# EAGLE design iGlass v3 (EAGLE 9.6.2)
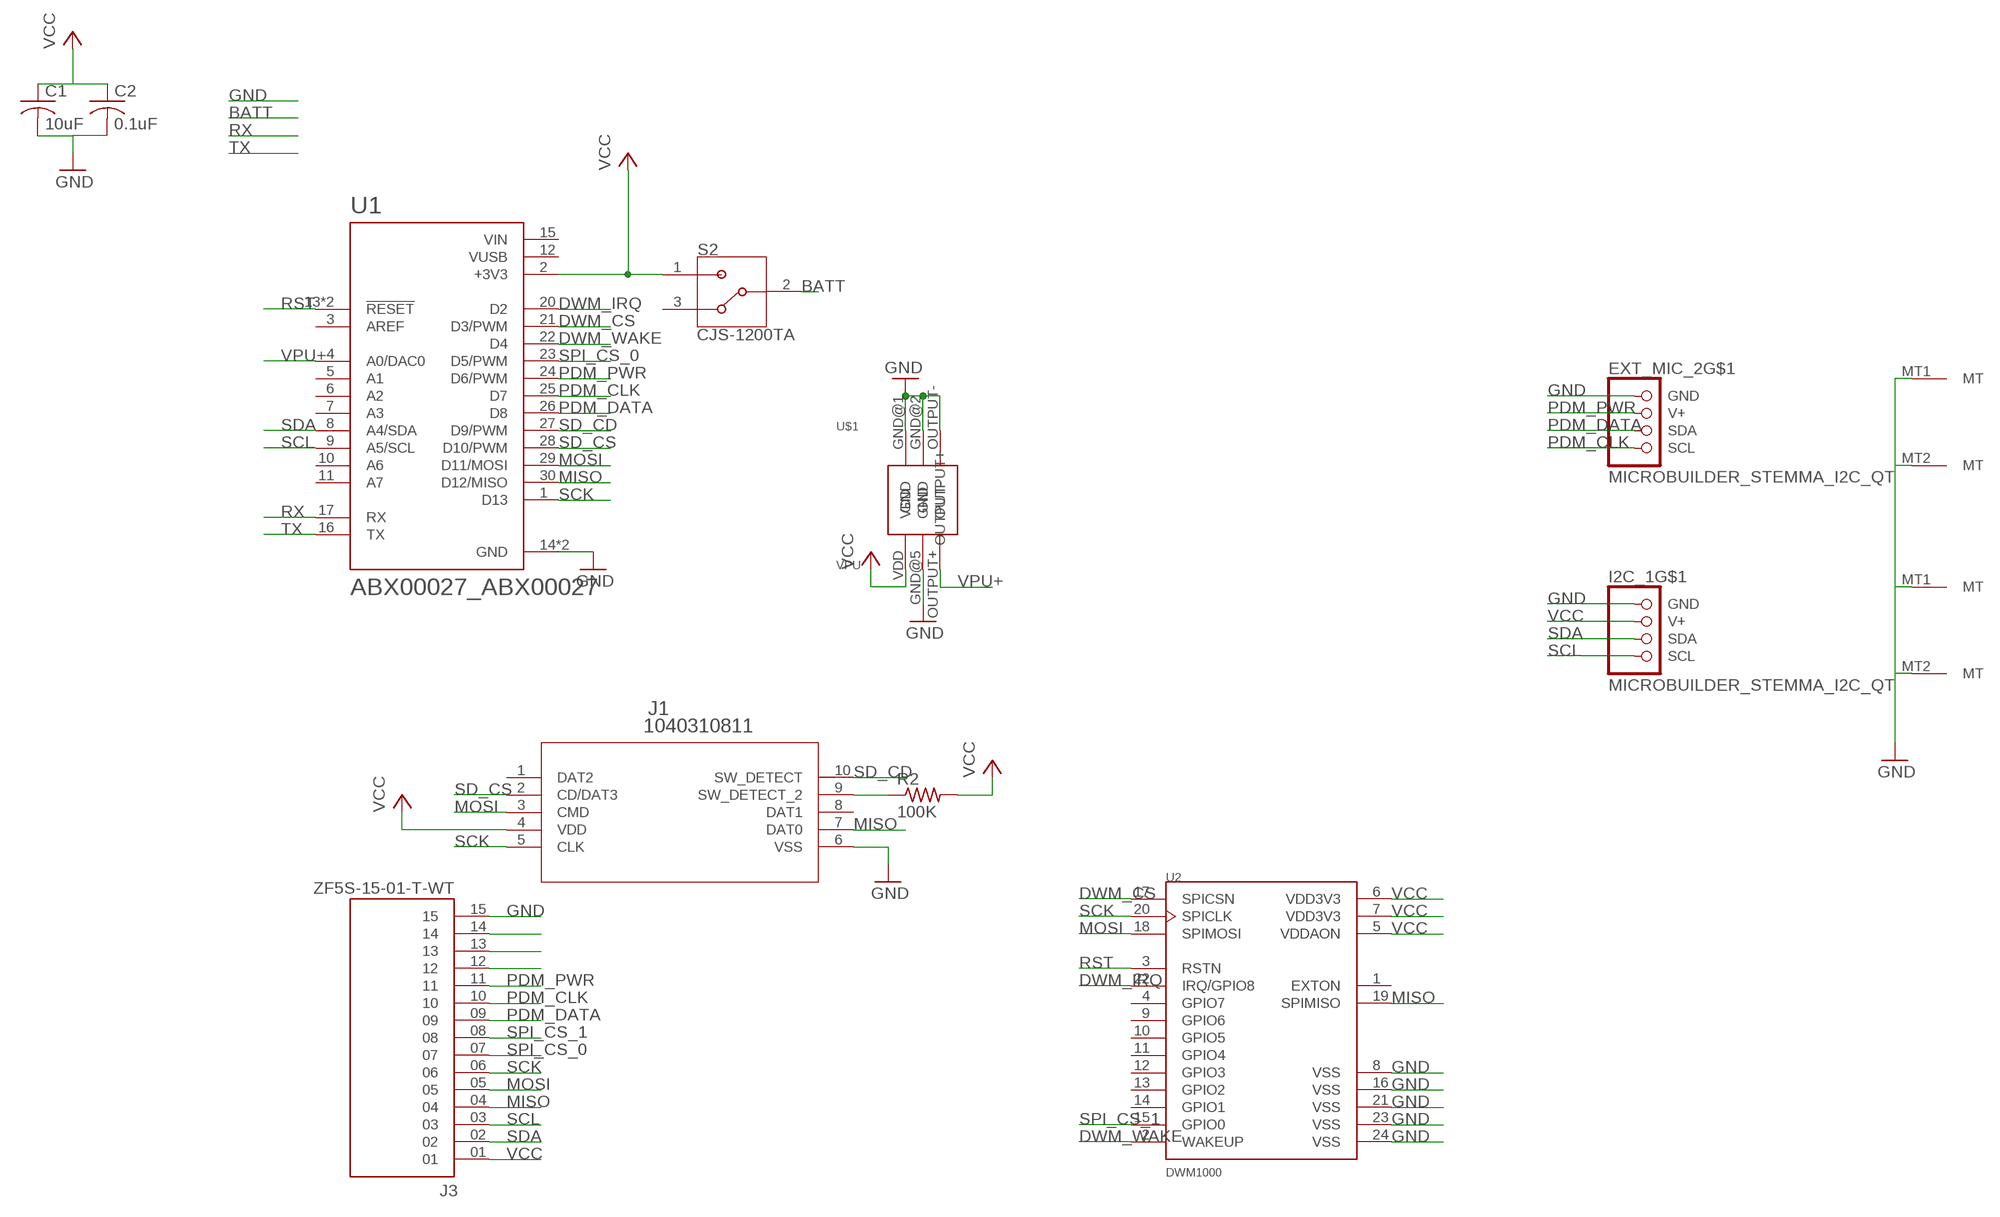
[diagram p0: schematic, sheet 1]

## Parts
C1  10uF  C-USC0805  [C0805]
C2  0.1uF  C-USC0805  [C0805]
EXT_MIC_2  MICROBUILDER_STEMMA_I2C_QT  [MICROBUILDER_JST_SH4]
I2C_1  MICROBUILDER_STEMMA_I2C_QT  [MICROBUILDER_JST_SH4]
J1  1040310811  [104031-0811_MOL]
J3  ZF5S-15-01-T-WT  [SAMTEC_ZF5S-15-01-T-WT]
R2  100K  R-US_R0805  [R0805]
S2  CJS-1200TA  [SW_CJS-1200TA]
U1  ABX00027_ABX00027  [ABX00027_MODULE_ABX00027]
U2  DWM1000  [XCVR_DWM1000]
U$1  VPU  [VPU]

## Nets
BATT: S2.2
DWM_CS: U1.21(D3/PWM) U2.17(SPICSN)
DWM_IRQ: U1.20(D2) U2.22(IRQ/GPIO8)
DWM_WAKE: U1.22(D4) U2.2(WAKEUP)
GND: C1.2 C2.2 EXT_MIC_2.1(GND) EXT_MIC_2.MT1(MT) EXT_MIC_2.MT2(MT) I2C_1.1(GND) I2C_1.MT1(MT) I2C_1.MT2(MT) J1.6(VSS) J3.14 J3.15 U1.14(GND) U1.19(GND) U2.8(VSS) U2.16(VSS) U2.21(VSS) U2.23(VSS) U2.24(VSS) U$1.GND@1(GND) U$1.GND@2(GND) U$1.GND@5(GND) U$1.OUTPUT-
MISO: J1.7(DAT0) J3.04 U1.30(D12/MISO) U2.19(SPIMISO)
MOSI: J1.3(CMD) J3.05 U1.29(D11/MOSI) U2.18(SPIMOSI)
N$3: J1.9(SW_DETECT_2) R2.1
N$4: J3.13
N$5: J3.12
PDM_CLK: EXT_MIC_2.4(SCL) J3.10 U1.25(D7)
PDM_DATA: EXT_MIC_2.3(SDA) J3.09 U1.26(D8)
PDM_PWR: EXT_MIC_2.2(V+) J3.11 U1.24(D6/PWM)
RST: U1.13(!RESET) U1.18(!RESET) U2.3(RSTN)
RX: U1.17(RX)
SCK: J1.5(CLK) J3.06 U1.1(D13) U2.20(SPICLK)
SCL: I2C_1.4(SCL) J3.03 U1.9(A5/SCL)
SD_CD: J1.10(SW_DETECT) U1.27(D9/PWM)
SD_CS: J1.2(CD/DAT3) U1.28(D10/PWM)
SDA: I2C_1.3(SDA) J3.02 U1.8(A4/SDA)
SPI_CS_0: J3.07 U1.23(D5/PWM)
SPI_CS_1: J3.08 U2.15(GPIO0)
TX: U1.16(TX)
VCC: C1.1 C2.1 I2C_1.2(V+) J1.4(VDD) J3.01 R2.2 S2.1 U1.2(+3V3) U2.5(VDDAON) U2.6(VDD3V3) U2.7(VDD3V3) U$1.VDD
VPU+: U1.4(A0/DAC0) U$1.OUTPUT+
Unconnected: J1.1(DAT2) J1.8(DAT1) S2.3 U1.3(AREF) U1.5(A1) U1.6(A2) U1.7(A3) U1.10(A6) U1.11(A7) U2.1(EXTON) U2.4(GPIO7) U2.9(GPIO6) U2.10(GPIO5) U2.11(GPIO4) U2.12(GPIO3) U2.13(GPIO2) U2.14(GPIO1)

## Power pins joined to a net without a drawn wire
VIN: U1.15(VIN)
VUSB: U1.12(VUSB)

## Library data of the parts
C1 C2 = rcl:C-US: CAPACITOR, American symbol
EXT_MIC_2 I2C_1 = smart-glasses:MICROBUILDER_STEMMA_I2C
J1 = micro_sd_slot:1040310811; COPYRIGHT: Copyright (C) 2021 Ultra Librarian. All rights reserved.; MANUFACTURER_PART_NUMBER: 1040310811; MFR_NAME: Molex Connector Corporation
J3 = ZF5S-15-01-T-WT:ZF5S-15-01-T-WT; MANUFACTURER: SAMTEC
R2 = resistor:R-US_: RESISTOR, American symbol
S2 = CJS-1200TA:CJS-1200TA: Switch Slide N.O./N.C. SPDT Raised Slide 0.1A 24VDC J-Hook SMD Embossed T/R Check availability <https://pricing.snapeda.com/parts/CJS-1200TA/Nidec%20Copal/view-part?ref=eda>; AVAILABILITY: In Stock; DESCRIPTION: Slide Switch SPDT Surface Mount; MF: Nidec Copal; MP: CJS-1200TA; PACKAGE: None; PRICE: None; PURCHASE-URL: https://pricing.snapeda.com/search/part/CJS-1200TA/?ref=eda
U1 = smart-glasses:ABX00027_ABX00027: ATSAMD21G18A Arduino Nano 33 IoT SAM D ARM® Cortex®-M0+ MCU 32-Bit Embedded Evaluation Board Check prices <https://pricing.snapeda.com/parts/ABX00027/Arduino/view-part?ref=eda>; AVAILABILITY: In Stock; DESCRIPTION: ATSAMD21G18A Arduino Nano 33 IoT SAM D ARM® Cortex®-M0+ MCU 32-Bit Embedded Evaluation Board; MF: Arduino; MP: ABX00027; PACKAGE: None; PRICE: None; PURCHASE-URL: https://pricing.snapeda.com/search/part/ABX00027/?ref=eda
U2 = DWM1000:DWM1000: Mod Ieee802.15.4-2011 Uwb Txrx Check availability <https://pricing.snapeda.com/parts/DWM1000/Qorvo/view-part?ref=eda>; AVAILABILITY: In Stock; DESCRIPTION: RX TXRX MODULE 802.15.4 CHIP SMD; MF: Qorvo; MP: DWM1000; PACKAGE: None; PRICE: None; PURCHASE-URL: https://pricing.snapeda.com/search/part/DWM1000/?ref=eda
U$1 = VPU:VPU

## Board
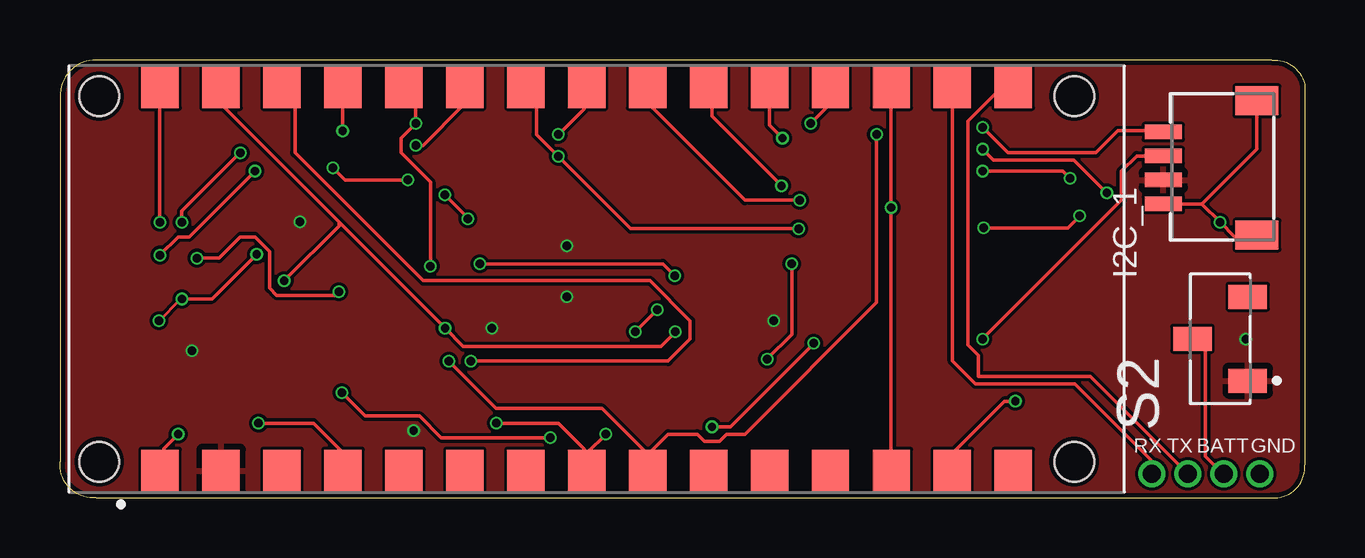
[diagram p1: board, top side]
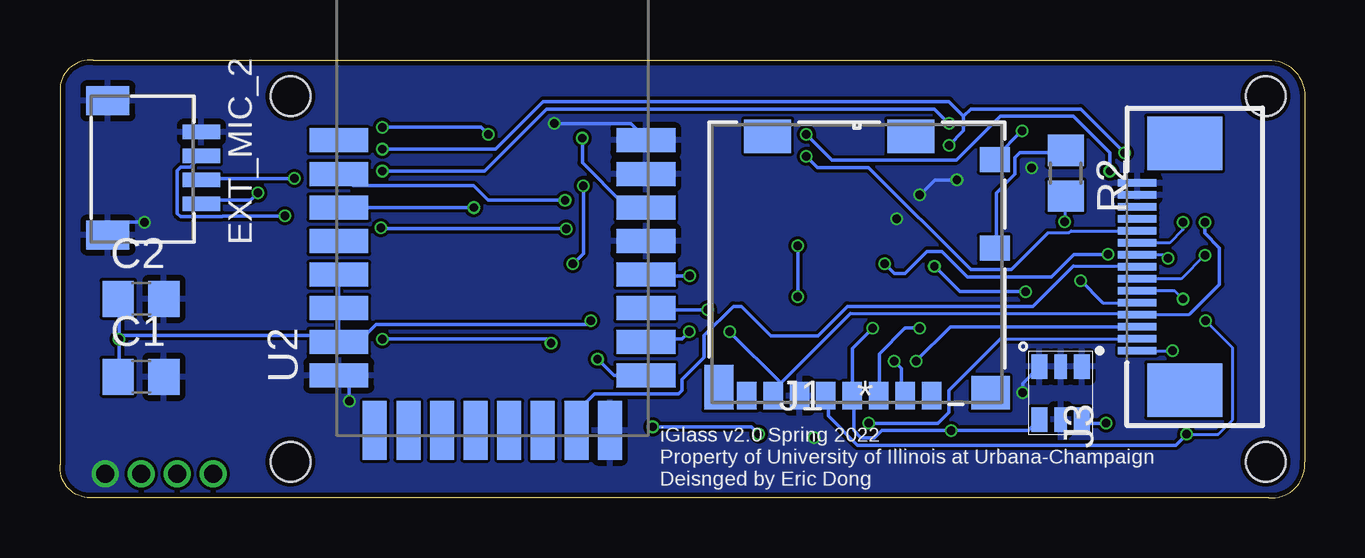
[diagram p2: board, bottom side, seen from below]

Size 51.89 x 18.26 mm. Coordinates in mm from the lower left corner, seen from the top.
Outline: 1.51,0.01 50.51,0.01 arc101 51.88,1.38 51.88,17.26 arc79 50.51,18.26 1.51,18.26 arc85 0.01,16.88 0.01,1.51 arc100 1.51,0.01
Copper layers (1*16): Top 0.035559375mm / dielectric 1.6mm / Bottom 0.035559375mm
Design rules "jlcpcb2layer": minimum track width 5mil, minimum drill 12mil, track to track 5mil, track to pad 5mil, pad to pad 5mil, via to via 5mil, smd to smd 5mil, copper to edge 8mil, drill to drill 6mil, minimum pad ring 5mil, minimum via ring 3mil, stop-mask expansion 2.5mil, vias tented up to drill 0mil, thermal gap 10mil

### Footprints (pad centres in the part's own frame; a part is rotated, then mirrored left to right if it is on the bottom)
C0805 = smd 1.3 x 1.5: 1 -0.95,0; 2 0.95,0
MICROBUILDER_JST_SH4 = smd 0.6 x 1.55: 1 -1.5,2.514; 2 -0.5,2.514; 3 0.5,2.514; 4 1.5,2.514 | smd 1.2 x 1.8: MT1 -2.8,-1.386; MT2 2.8,-1.386
104031-0811_MOL = smd 0.813 x 1.143: 1 3.105,-5.521; 2 2.005,-5.521; 3 0.905,-5.521; 4 -0.195,-5.521; 5 -1.295,-5.521; 6 -2.395,-5.521; 7 -3.495,-5.521; 8 -4.595,-5.521 | smd 1.245 x 1.041: 9 5.74,0.628; 10 5.74,4.329 | smd 1.6 x 1.397: 11 5.565,-5.396 | smd 1.219 x 1.854: 12 -5.755,-5.171 | smd 1.956 x 1.397: 13 -3.73,5.303; 14 2.24,5.303
SAMTEC_ZF5S-15-01-T-WT = smd 0.3 x 1.6: 01 -3.5,1.98; 02 -3,1.98; 03 -2.5,1.98; 04 -2,1.98; 05 -1.5,1.98; 06 -1,1.98; 07 -0.5,1.98; 08 0,1.98; 09 0.5,1.98; 10 1,1.98; 11 1.5,1.98; 12 2,1.98; 13 2.5,1.98; 14 3,1.98; 15 3.5,1.98 | smd 2.24 x 3.12: S1 -5.147,0; S2 5.147,0
R0805 = smd 1.3 x 1.5: 1 -0.95,0; 2 0.95,0
SW_CJS-1200TA = smd 1 x 1.6: 1 -1.75,-1.15; 2 0,1.15; 3 1.75,-1.15
ABX00027_MODULE_ABX00027 = smd 1.56 x 1.75: 1 -18.19,-8; 2 -15.65,-8; 3 -13.11,-8; 4 -10.57,-8; 5 -8.03,-8; 6 -5.49,-8; 7 -2.95,-8; 8 -0.41,-8; 9 2.13,-8; 10 4.67,-8; 11 7.21,-8; 12 9.75,-8; 13 12.29,-8; 14 14.83,-8; 15 17.37,-8; 16 17.37,8; 17 14.83,8; 18 12.29,8; 19 9.75,8; 20 7.21,8; 21 4.67,8; 22 2.13,8; 23 -0.41,8; 24 -2.95,8; 25 -5.49,8; 26 -8.03,8; 27 -10.57,8; 28 -13.11,8; 29 -15.65,8; 30 -18.19,8 | hole 1.651: -20.73,-7.62; -20.73,7.62; 19.91,7.62; 19.91,-7.62
XCVR_DWM1000 = smd 2.45 x 1: 1 -6.4,1.8; 2 -6.4,0.4; 3 -6.4,-1; 4 -6.4,-2.4; 5 -6.4,-3.8; 6 -6.4,-5.2; 7 -6.4,-6.6; 8 -6.4,-8; 17 6.4,-8; 18 6.4,-6.6; 19 6.4,-5.2; 20 6.4,-3.8; 21 6.4,-2.4; 22 6.4,-1; 23 6.4,0.4; 24 6.4,1.8 | smd 1 x 2.45: 9 -4.9,-10.295; 10 -3.5,-10.295; 11 -2.1,-10.295; 12 -0.7,-10.295; 13 0.7,-10.295; 14 2.1,-10.295; 15 3.5,-10.295; 16 4.9,-10.295
VPU = smd 0.662 x 1.03: GND@1 -0.884,1.105; OUTPUT+ 0.884,-1.105; OUTPUT- 0.884,1.105; VDD -0.884,-1.105 | smd 0.533 x 1.03: GND@2 0,1.105; GND@5 0,-1.105

### Placement (x,y rotation side)
C1  48.51,5.05 0 bottom
C2  48.51,8.3 0 bottom
EXT_MIC_2  48.51,13.76 270 bottom
I2C_1  48.51,13.76 90 top
J1  18.67,9.78 0 bottom
J3  5.01,9.63 90 bottom
R2  9.97,13.54 270 bottom
S2  48.36,6.63 90 top
U1  22.37,9.13 0 top
U2  33.87,13.11 0 bottom
U$1  10.18,4.37 0 bottom

### Tracks (layer width: path | path; a pad name or v marks a point on that pad's centre or on a via)
BATT  (via drill 0.75)
  Top 0.152: S2.2 47.29,6.61 47.75,6.16 47.75,1.74 48.48,1.01 v48.51,1.01
DWM_CS  (via drill 0.35)
  Top 0.152: v30.07,13.02 27.18,15.91 27.18,16.98 U1.21 | v30.51,9.76 30.51,6.81 v29.48,5.78
  Bottom 0.152: v30.07,13.02 30.07,10.19 v30.51,9.76 | v29.48,5.78 28.8,5.11 U2.17
DWM_IRQ  (via drill 0.35)
  Top 0.152: v30.11,15 29.58,15.53 U1.20
  Bottom 0.152: v30.11,15 30.11,13.97 28.39,12.25 27.48,12.25 U2.22
DWM_WAKE  (via drill 0.35)
  Top 0.152: v30.83,12.41 28.55,12.41 24.58,16.37 24.58,16.98 U1.22
  Bottom 0.152: v30.83,12.41 34.03,12.41 34.64,13.02 39.67,13.02 40.13,13.47 U2.2
GND  (via drill 0.35, 0.75)
  Top 0.152: 47.6,12.25 46.07,12.25 I2C_1.1 | 47.6,12.25 v48.36,11.49 48.97,10.88 49.88,10.88 EXT_MIC_2.MT2 | 47.6,12.25 49.88,14.54 49.88,16.52 EXT_MIC_2.MT1 | v39.82,4.02 39.37,4.02 37.23,1.89 37.23,1.13 U1.14 | v31.29,15.61 32.05,16.37 32.05,16.98 U1.19 | v20.44,2.5 15.9,2.5 14.99,3.41 12.73,3.41 v11.76,4.38 | v11.38,13.76 11.89,13.25 v14.5,13.25 | v16.05,12.63 17.01,11.67 v17.01,11.63
  Bottom 0.152: v39.82,4.02 39.82,4.79 40.13,5.09 U2.8 | v31.29,15.61 28.09,15.61 27.48,15 U2.24 | v48.36,11.49 49.43,11.49 49.88,11.03 EXT_MIC_2.MT2 | U$1.GND@1 11.76,4.78 v11.76,4.38 | v14.5,13.25 15.43,13.25 v16.05,12.63
  other vias: 50.01,1.01
  pour Bottom: 0.01,18.76 0.01,-0.74 52.01,-0.74 52.01,18.76
MISO  (via drill 0.35)
  Top 0.152: v4.16,11.49 4.16,16.98 U1.30 | v23.98,6.92 v24.89,7.83
  Bottom 0.127: 4.77,7.68 4.82,7.63 J3.04 7.04,7.68 18.95,7.68
  Bottom 0.152: 21.84,4.79 21.84,4.63 22.15,4.33 J1.7 21.84,4.79 | 21.84,4.79 18.95,7.68 | v4.16,11.49 4.16,11.03 3.55,10.42 3.55,8.9 4.77,7.68 | v24.89,7.83 27.33,7.83 U2.19 | 21.84,4.79 v23.98,6.92
MOSI  (via drill 0.35)
  Top 0.152: 11.63,11.49 6.75,16.37 6.75,16.98 U1.29 | 11.63,11.49 v16.05,7.07 16.81,6.31 25.04,6.31 v25.65,6.92 | v9.34,9.05 11.63,11.34 11.63,11.49
  Bottom 0.127: 8.43,8.14 8.42,8.13 J3.05
  Bottom 0.152: v16.05,7.07 16.66,7.07 17.73,6 17.73,4.33 J1.3 | v9.34,9.05 8.43,8.14 | v25.65,6.92 25.96,6.61 27.33,6.61 U2.18
N$3
  Bottom 0.152: J1.9 12.85,10.42 12.85,12.71 12.07,13.49 12.07,14.19 11.88,14.39 10.11,14.39 R2.1
PDM_CLK  (via drill 0.35)
  Top 0.152: v43.63,12.71 42.26,14.08 38.91,14.08 v38.45,14.54 | v14.83,14.69 15.14,14.69 16.81,16.37 16.81,16.98 U1.25 | v5.08,11.49 5.08,11.95 v7.52,14.39
  Bottom 0.127: 5.08,11.19 5.63,10.63 J3.10
  Bottom 0.152: v43.63,12.71 43.94,12.41 45.92,12.41 EXT_MIC_2.4 | v38.45,14.54 33.73,14.54 31.75,16.52 14.83,16.52 14.22,15.91 | 14.22,15.91 14.22,15.3 v14.83,14.69 | v5.08,11.49 5.08,11.19 | v7.52,14.39 9.34,16.22 13.92,16.22 14.22,15.91
PDM_DATA  (via drill 0.35)
  Top 0.152: v42.11,13.32 41.81,13.62 v38.45,13.62 | U1.26 14.37,16.98 14.83,16.52 v14.83,15.61 14.22,15 14.22,14.39 15.44,13.17 v15.44,9.66 | v5.7,9.99 6.63,9.99 7.52,10.88 8.13,10.88 8.74,10.27 8.74,8.75 9.04,8.44 11.48,8.44 v11.63,8.6
  Bottom 0.127: v5.7,9.99 5.84,10.13 J3.09
  Bottom 0.152: v42.11,13.32 45.92,13.32 EXT_MIC_2.3 | v38.45,13.62 34.19,13.62 31.6,16.22 15.44,16.22 v14.83,15.61 | v11.63,8.6 14.37,8.6 v15.44,9.66
PDM_PWR  (via drill 0.35)
  Top 0.152: v30.79,11.22 23.79,11.22 v20.77,14.23 19.86,15.15 19.86,16.67 19.56,16.98 U1.24 | v42.51,11.76 42.01,11.26 v38.51,11.26
  Bottom 0.127: J3.11 9.74,11.13 9.82,11.05 10.7,11.05 10.72,11.03
  Bottom 0.152: 10.72,11.03 12.24,9.51 13.92,9.51 18.18,13.78 20.32,13.78 v20.77,14.23 | v42.51,11.76 45.09,11.76 45.12,11.73 46.86,11.73 47,11.86 47,13.65 46.86,13.79 46.46,13.79 EXT_MIC_2.2 | v38.51,11.26 38.47,11.22 v30.79,11.22
RST  (via drill 0.35)
  Top 0.152: U1.13 34.64,1.13 v34.64,12.1 34.64,16.98 U1.18
  Bottom 0.152: v34.64,12.1 40.13,12.1 U2.3
RX  (via drill 0.75)
  Top 0.152: U1.17 37.2,5.7 38.15,4.75 42.29,4.75 45.46,1.59 45.46,1.05 v45.51,1.01
SCK  (via drill 0.35)
  Top 0.127: v4.13,7.38 5.04,8.29 v5.08,8.29
  Top 0.152: v4.93,2.65 4.32,2.04 4.32,1.13 U1.1 | v8.2,10.15 6.34,8.29 v5.08,8.29 | v17.51,9.76 25.13,9.76 v25.63,9.26
  Bottom 0.127: v4.93,2.65 3.61,2.65 3.01,3.26 3.01,6.26 v4.13,7.38 | v5.08,8.29 5.42,8.63 J3.06
  Bottom 0.152: v4.93,2.65 5.38,2.19 18.64,2.19 19.86,3.41 19.86,4.18 J1.5 | v8.2,10.15 9.62,10.15 10.56,9.21 14.07,9.21 15.14,10.27 15.75,10.27 16.66,9.36 17.11,9.36 v17.51,9.76 | U2.20 27.33,9.36 27.23,9.26 v25.63,9.26
SCL  (via drill 0.35)
  Top 0.152: v38.45,15.45 39.52,14.39 43.18,14.39 44.09,15.3 45.95,15.3 I2C_1.4 | v34.03,15.15 34.03,8.14 28.55,2.65 27.79,2.65 27.48,2.35 26.87,2.35 26.57,2.65 25.35,2.65 24.58,1.89 24.58,1.74 | 24.58,1.74 24.58,1.13 U1.9 24.58,1.74 | v16.2,5.7 18.18,3.72 22.6,3.72 24.58,1.74
  Bottom 0.152: v38.45,15.45 34.34,15.45 v34.03,15.15 | J3.03 14.77,7.13 v16.2,5.7
SD_CD  (via drill 0.35)
  Top 0.152: v11.78,15.3 11.78,16.98 U1.27
  Bottom 0.152: v11.78,15.3 12.85,14.23 J1.10
SD_CS  (via drill 0.35)
  Top 0.152: v17.12,5.7 25.35,5.7 26.26,6.61 26.26,7.38 24.58,9.05 15.14,9.05 9.8,14.39 9.8,16.52 9.34,16.98 U1.28
  Bottom 0.152: v17.12,5.7 16.81,5.4 16.81,4.33 J1.2
SDA  (via drill 0.35)
  Top 0.152: v38.45,6.61 44.24,12.41 44.24,13.62 44.88,14.26 I2C_1.3 | v31.42,6.44 27.94,2.96 v27.18,2.96 | v22.76,2.65 21.99,1.89 21.99,1.74 | 21.99,1.74 21.99,1.13 U1.8 21.99,1.74 | v18.18,3.11 20.77,3.11 21.84,2.04 21.84,1.89 21.99,1.74
  Bottom 0.127: 12.7,6.61 12.68,6.63 J3.02
  Bottom 0.152: v38.45,6.61 31.6,6.61 v31.42,6.44 | v27.18,2.96 23.06,2.96 v22.76,2.65 | 12.7,6.61 14.83,4.48 14.83,3.57 15.29,3.11 v18.18,3.11
SPI_CS_0  (via drill 0.35)
  Top 0.152: v4.16,10.12 4.93,10.88 5.38,10.88 v8.13,13.62 | v20.77,15.15 21.84,16.22 21.84,16.98 U1.23
  Bottom 0.127: J3.07 5.15,9.13 v4.16,10.12
  Bottom 0.152: v8.13,13.62 8.13,14.39 9.65,15.91 12.7,15.91 14.53,14.08 19.71,14.08 v20.77,15.15
SPI_CS_1
  Bottom 0.127: 9.65,9.66 7.02,9.66 J3.08
  Bottom 0.152: 9.65,9.66 11.33,7.99 19.07,7.99 20.3,6.76 22.26,6.76 23.49,7.99 23.82,7.99 25.04,6.77 25.04,5.85 25.96,4.94 25.96,4.48 26.11,4.33 29.61,4.33 30.22,3.72 30.22,2.96 U2.15
TX  (via drill 0.75)
  Top 0.152: v47.01,1.01 42.95,5.06 38.27,5.06 38.27,5.93 37.85,6.36 37.85,15.71 39.27,17.13 U1.16
VCC  (via drill 0.35)
  Bottom 0.127: J3.01 v5.51,6.13 | R2.2 10.01,12.55 v10.01,11.51
  Bottom 0.152: 49.43,6.77 49.43,8.29 C2.1 | 49.43,6.77 v49.43,6.61 49.43,5.09 C1.1 | 40.28,6.77 40.28,7.83 U2.6 40.28,7.99 40.28,9.21 U2.5 | 40.28,6.77 40.28,6.61 U2.7 | 40.28,6.77 49.43,6.77 | 40.28,6.77 U2.7 | 11.02,3.57 11.02,3.26 U$1.VDD | 11.17,3.11 U$1.VDD | 9.95,12.71 R2.2 | U$1.VDD 11.52,2.8 v14.74,2.8 17.63,2.8 17.93,2.5 18.49,2.5 18.79,2.8 18.79,4.18 J1.4 18.86,6.22 v18.01,7.07 | U2.7 39.42,6.51 38.7,7.22 29.92,7.22 v29.76,7.38 | v21.13,8.38 v21.13,10.51
  pour Top: -0.49,19.26 -0.49,-1.24 52.51,-1.24 52.51,19.26
VPU+  (via drill 0.35)
  Top 0.152: v8.28,3.11 10.56,3.11 11.78,1.89 11.78,1.13 U1.4
  Bottom 0.152: v8.28,3.11 9.19,3.11 U$1.OUTPUT+

### Text on the board
tPlace: RX | TX | BATT | GND
bPlace: iGlass v2.0 Spring 2022 / Property of University of Illinois at Urbana-Champaign / Deisnged by Eric Dong